# EAGLE schematic MSSRP-USER_IF (EAGLE 6.6.0)
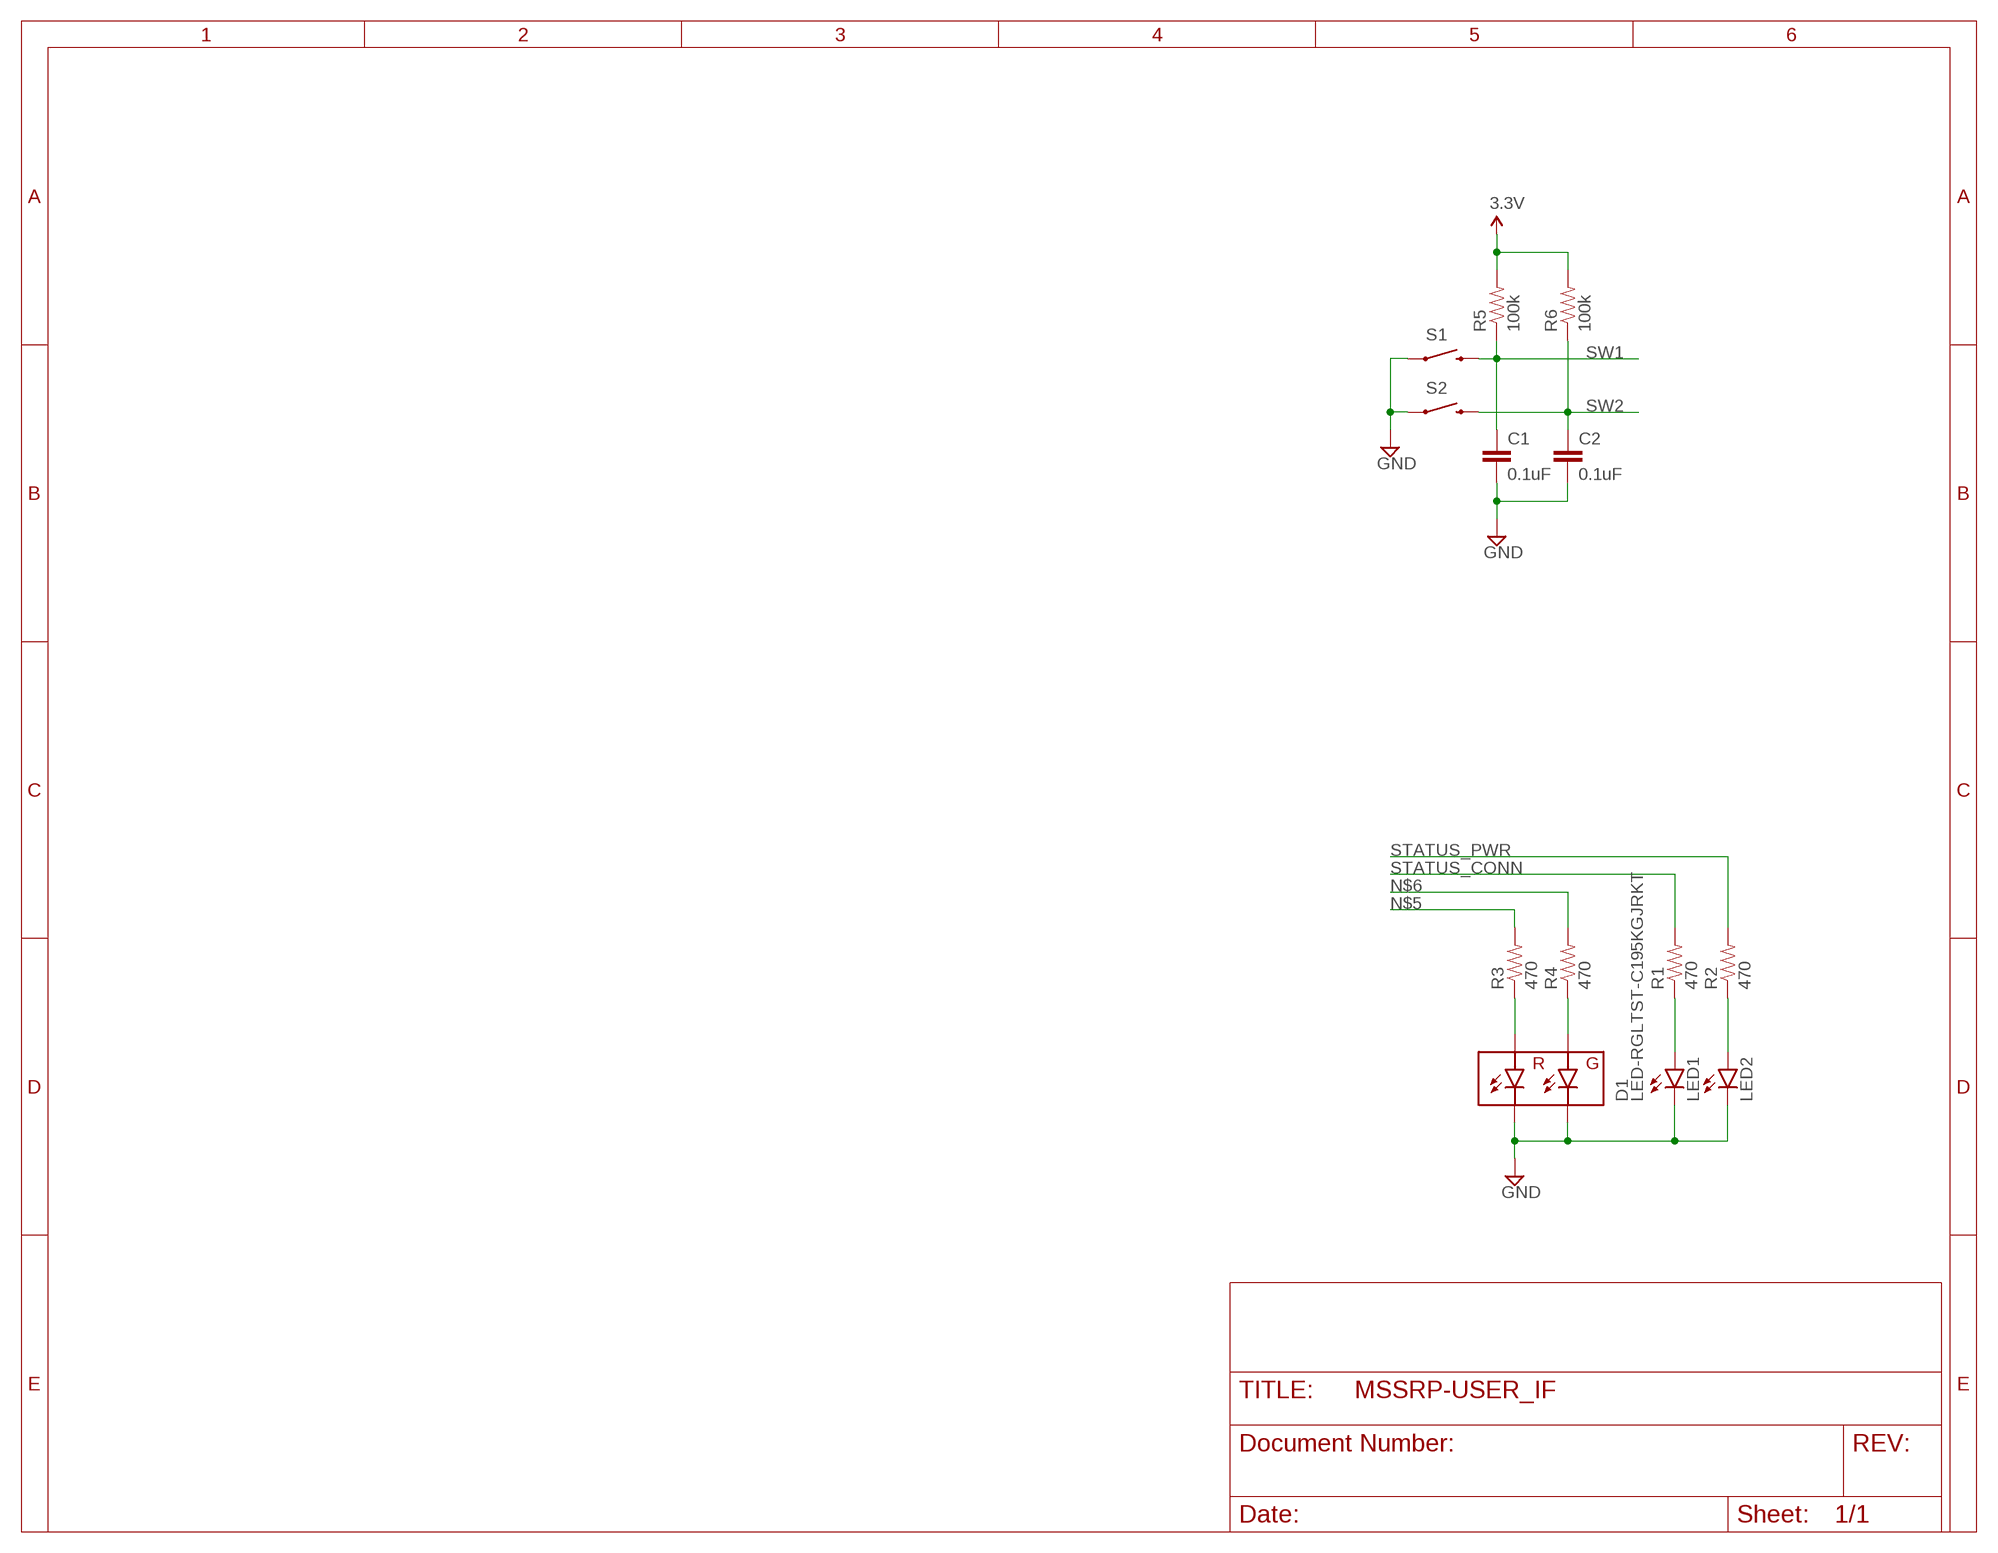
[diagram p0: schematic, sheet 1]

## Parts
C1  0.1uF  0.1UF-25V-5%(0603)  [0603-CAP]
C2  0.1uF  0.1UF-25V-5%(0603)  [0603-CAP]
D1  LED-RGLTST-C195KGJRKT  [LTST-C195KGJRKT]
LED1  LED0603  [LED-0603]
LED2  LED0603  [LED-0603]
R1  470  470OHM1/10W1%(0603)  [0603-RES]
R2  470  470OHM1/10W1%(0603)  [0603-RES]
R3  470  470OHM1/10W1%(0603)  [0603-RES]
R4  470  470OHM1/10W1%(0603)  [0603-RES]
R5  100k  100KOHM1/10W1%(0603)  [0603-RES]
R6  100k  100KOHM1/10W1%(0603)  [0603-RES]
S1  SWITCH-MOMENTARY-2-SMD-1101NE  [TACTILE-SWITCH-1101NE]
S2  SWITCH-MOMENTARY-2-SMD-1101NE  [TACTILE-SWITCH-1101NE]

## Nets
3.3V: R5.2 R6.2
GND: C1.2 C2.2 D1.P$3(GC) D1.P$4(RC) LED1.C LED2.C S1.P$1 S2.P$1
N$1: D1.P$2(RA) R3.1
N$2: D1.P$1(GA) R4.1
N$3: LED1.A R1.1
N$4: LED2.A R2.1
N$5: R3.2
N$6: R4.2
STATUS_CONN: R1.2
STATUS_PWR: R2.2
SW1: C1.1 R5.1 S1.P$2
SW2: C2.1 R6.1 S2.P$2

## Library data of the parts
C1 C2 = SparkFun-Capacitors:0.1UF-25V-5%(0603): CAP-08604; PROD_ID: CAP-08604
D1 = SparkFun-LED:LED-RG; PROD_ID: DIO-12140
LED1 LED2 = SparkFun-LED:LED: LEDs Standard schematic elements and footprints for 5mm, 3mm, 1206, and 0603 sized LEDs. 5mm - Spark Fun Electronics SKU : COM-00529 (and others)
R1-R4 = SparkFun-Resistors:470OHM1/10W1%(0603): RES-07869; PROD_ID: RES-07869
R5 R6 = SparkFun-Resistors:100KOHM1/10W1%(0603): RES-07828; PROD_ID: RES-07828
S1 S2 = SparkFun-Electromechanical:SWITCH-MOMENTARY-2: Various NO switches- pushbuttons, reed, etc